# EAGLE design WaterLevel (EAGLE 6.1)
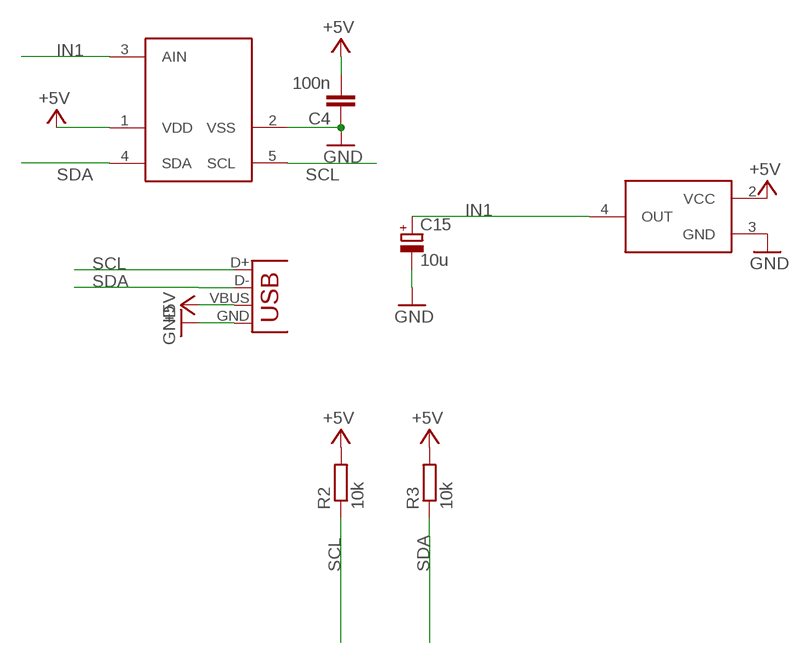
[diagram p0: schematic, sheet 1]

## Parts
C4  100n  C-EUC0805K  [C0805K]
C15  10u  CPOL-EUA/3216-18W  [A/3216-18W]
IC1  MPVZ5004GW7U  [MPVZ5004GW7U]
R2  10k  R-EU_R0805  [R0805]
R3  10k  R-EU_R0805  [R0805]
U$2  MCP3221A7  MCP3221  [SOT23-5]
X5  USBSMD  [USB-MINIB]

## Nets
+5V: C4.2 IC1.2(VCC) R2.2 R3.2 U$2.1(VDD) X5.VBUS
GND: C4.1 C15.- IC1.3(GND) U$2.2(VSS) X5.GND
IN1: C15.+ IC1.4(OUT) U$2.3(AIN)
SCL: R2.1 U$2.5(SCL) X5.D+
SDA: R3.1 U$2.4(SDA) X5.D-

## Library data of the parts
C4 = rcl:C-EU: CAPACITOR, European symbol
C15 = rcl:CPOL-EU: POLARIZED CAPACITOR, European symbol
IC1 = pressure-sensor:MPVZ5004GW7U
R2 R3 = rcl:R-EU_: RESISTOR, European symbol
U$2 = MCP3426:MCP3221
X5 = SparkFun:USB: USB Connectors USB-B-PTH is fully proven SKU : PRT-00139 USB-miniB is fully proven SKU : PRT-00587 USB-A-PCB is untested. USB-A-H is throughly reviewed, but untested. Spark Fun Electronics SKU : PRT-00437 USB-B-SMT is throughly reviewed, but untested. Needs silkscreen touching up. USB-A-S has not been used/tested USB-MB-H has not been used/tested

## Net classes
0 default: width 0.305 mm, drill 0.305 mm, clearance 0.203 mm
2 gnd: width 0.305 mm, drill 0.508 mm, clearance 0.203 mm

## Board
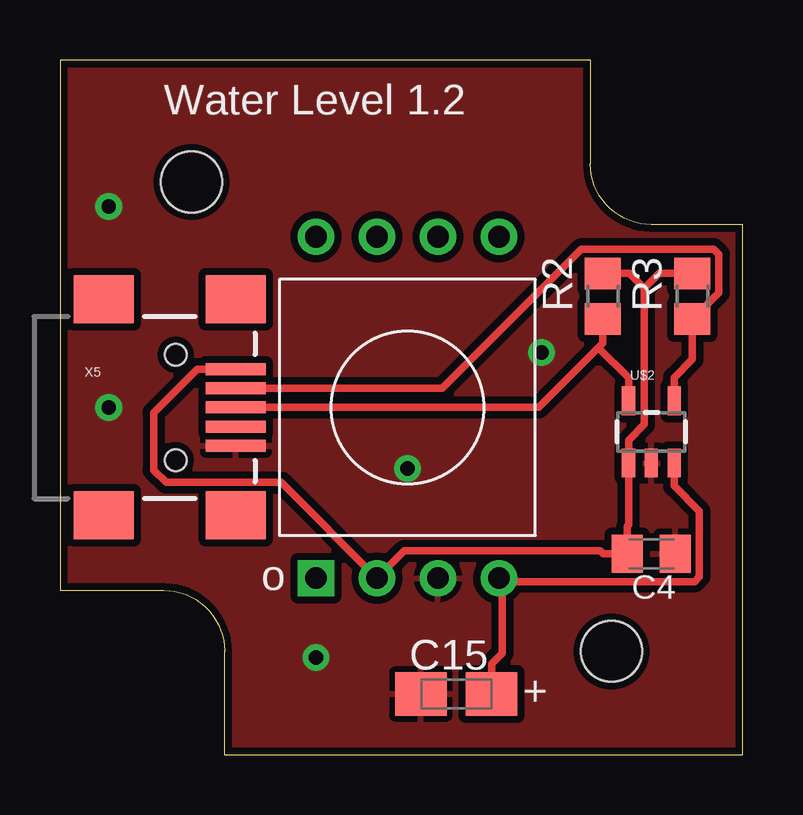
[diagram p1: board, top side]
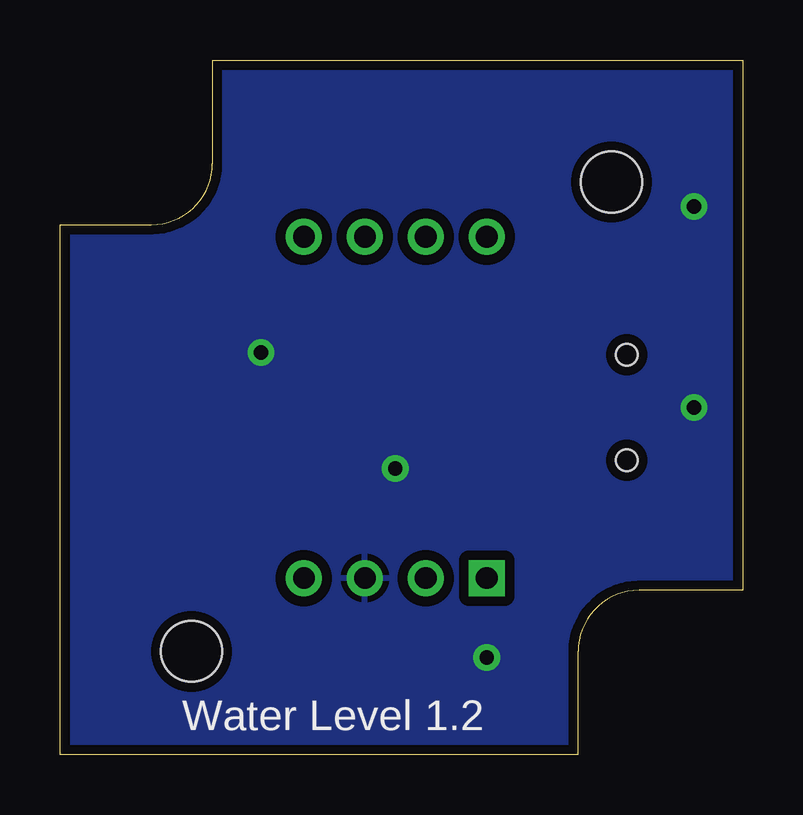
[diagram p2: board, bottom side, seen from below]

Size 28.45 x 28.96 mm. Coordinates in mm from the lower left corner, seen from the top.
Outline: 28.45,22.1 28.45,0 6.86,0 6.86,4.32 arc90 4.32,6.86
Outline: 0,6.86 0,28.96 22.1,28.96 22.1,24.64 arc90 24.64,22.1
Outline: 0,6.86 4.32,6.86
Outline: 0,6.86 4.32,6.86
Outline: 28.45,22.1 24.64,22.1
Outline: 28.45,22.1 24.64,22.1
Copper layers (1*16): Top 0.035mm / dielectric 1.5mm / Bottom 0.035mm
Design rules: minimum track width 8mil, minimum drill 20mil, track to track 8mil, track to pad 8mil, pad to pad 8mil, via to via 8mil, smd to smd 8mil, copper to edge 10mil, drill to drill 8mil, minimum pad ring 12mil, minimum via ring 10mil, stop-mask expansion 4mil, vias tented up to drill 25mil, thermal gap 10mil
Holes 2.54 mm at 22.97,4.32 5.47,23.88

### Footprints (pad centres in the part's own frame; a part is rotated, then mirrored left to right if it is on the bottom)
C0805K = smd 1.3 x 1.6: 1 -1,0; 2 1,0
A/3216-18W = smd 2.15 x 1.8: + 1.475,0; - -1.475,0
MPVZ5004GW7U = drill 0.9 square: 1 7.112,-3.81 | drill 0.9: 2 7.112,-1.27; 3 7.112,1.27; 4 7.112,3.81; 5 -7.112,3.81; 6 -7.112,1.27; 7 -7.112,-1.27; 8 -7.112,-3.81
R0805 = smd 1.3 x 1.5: 1 -0.95,0; 2 0.95,0
SOT23-5 = smd 0.55 x 1.2: 1 -0.95,-1.3; 2 0,-1.3; 3 0.95,-1.3; 4 0.95,1.3; 5 -0.95,1.3
USB-MINIB = smd 2.5 x 0.5: D+ 2.5,0; D- 2.5,0.8; GND 2.5,-1.6; ID 2.5,-0.8; VBUS 2.5,1.6 | smd 2.5 x 2: GND@1 -3,-4.5; GND@2 -3,4.5; GND@3 2.5,4.5; GND@4 2.5,-4.5 | hole 0.9: 0,2.2; 0,-2.2

### Placement (x,y rotation side)
C4  24.64,8.38 180 top
C15  16.51,2.54 0 top
IC1  14.48,14.48 270 top
R2  22.62,19.11 90 top
R3  26.35,19.11 90 top
U$2  24.64,13.46 0 top
X5  4.83,14.48 0 top

### Tracks (layer width: path | path; a pad name or v marks a point on that pad's centre or on a via)
+5V
  Top 0.305: 24.34,19.45 23.72,20.06 R2.2 | 24.34,19.45 24.34,13.77 23.69,13.12 U$2.1 23.69,9.59 23.64,9.54 C4.2 22.63,8.38 22.51,8.5 14.34,8.5 IC1.2 9.22,11.35 4.42,11.35 3.9,11.87 3.9,14.26 5.72,16.08 X5.VBUS | R3.2 24.96,20.06 24.34,19.45
GND  (via drill 0.6)
  other vias: 14.48,11.94 10.67,4.06 2.03,14.48 2.03,22.86 20.07,16.76
  pour Top (isolate 0.305): 0,29.21 30.48,29.21 30.48,0 0,0
  pour Bottom (isolate 0.406): 0,29.21 30.48,29.21 30.48,0 0,0
IN1
  Top 0.305: C15.+ 17.98,3.8 18.43,4.24 18.43,7.23 | 18.43,7.23 IC1.4 | 18.43,7.23 26.44,7.23 26.64,7.43 26.64,10.15 25.59,11.21 U$2.3
SCL
  Top 0.305: 22.43,16.97 22.62,17.16 R2.1 | X5.D+ 19.94,14.48 22.43,16.97 | 22.43,16.97 23.69,15.72 U$2.5
SDA
  Top 0.305: U$2.4 25.59,15.72 26.35,16.48 R3.1 27.45,19.27 27.45,20.86 27.23,21.08 21.72,21.08 15.92,15.28 X5.D-

### Text on the board
tPlace: Water Level 1.2 | o | +
bPlace: Water Level 1.2